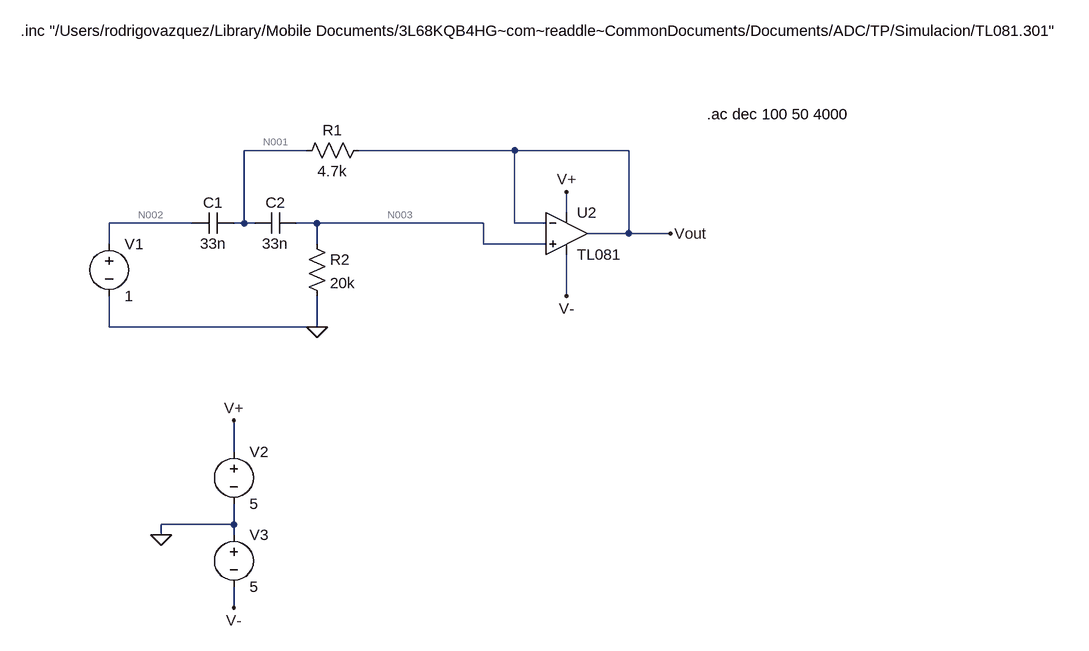
[diagram p0: schematic PasaAlto.asc]
PasaAlto.asc, the LTspice schematic file:
Version 4
SHEET 1 1524 828
WIRE 336 64 240 64
WIRE 656 64 416 64
WIRE 832 64 656 64
WIRE 736 160 736 128
WIRE 160 176 32 176
WIRE 240 176 240 64
WIRE 240 176 224 176
WIRE 256 176 240 176
WIRE 352 176 320 176
WIRE 608 176 352 176
WIRE 656 176 656 64
WIRE 704 176 656 176
WIRE 832 192 832 64
WIRE 832 192 768 192
WIRE 896 192 832 192
WIRE 32 208 32 176
WIRE 352 208 352 176
WIRE 608 208 608 176
WIRE 704 208 608 208
WIRE 736 288 736 224
WIRE 32 336 32 288
WIRE 352 336 352 288
WIRE 352 336 32 336
WIRE 224 528 224 480
WIRE 224 640 224 608
WIRE 224 640 112 640
WIRE 112 656 112 640
WIRE 224 656 224 640
WIRE 224 768 224 736
FLAG 112 656 0
FLAG 224 768 V-
FLAG 224 480 V+
FLAG 736 128 V+
FLAG 736 288 V-
FLAG 352 336 0
FLAG 896 192 Vout
SYMBOL cap 224 160 R90
WINDOW 0 0 32 VBottom 2
WINDOW 3 32 32 VTop 2
SYMATTR InstName C1
SYMATTR Value 33n
SYMBOL cap 320 160 R90
WINDOW 0 0 32 VBottom 2
WINDOW 3 32 32 VTop 2
SYMATTR InstName C2
SYMATTR Value 33n
SYMBOL res 336 192 R0
SYMATTR InstName R2
SYMATTR Value 20k
SYMBOL res 432 48 R90
WINDOW 0 0 56 VBottom 2
WINDOW 3 32 56 VTop 2
SYMATTR InstName R1
SYMATTR Value 4.7k
SYMBOL opamp2 736 128 R0
SYMATTR InstName U2
SYMATTR Value TL081
SYMBOL voltage 224 512 R0
SYMATTR InstName V2
SYMATTR Value 5
SYMBOL voltage 224 640 R0
SYMATTR InstName V3
SYMATTR Value 5
SYMBOL voltage 32 192 R0
SYMATTR InstName V1
SYMATTR Value 1
SYMATTR Value2 AC 1
TEXT -104 -120 Left 2 !.inc "/Users/rodrigovazquez/Library/Mobile Documents/3L68KQB4HG~com~readdle~CommonDocuments/Documents/ADC/TP/Simulacion/TL081.301"
TEXT 952 8 Left 2 !.ac dec 100 50 4000

The netlist it stands for:
* PasaAlto.asc
C1 N001 N002 33n
C2 N003 N001 33n
R2 N003 0 20k
R1 Vout N001 4.7k
XU2 N003 Vout V+ V- Vout TL081  ; pins In+ In- V+ V- OUT
V2 V+ 0 5
V3 0 V- 5
V1 N002 0 1 AC 1
.inc "/Users/rodrigovazquez/Library/Mobile Documents/3L68KQB4HG~com~readdle~CommonDocuments/Documents/ADC/TP/Simulacion/TL081.301"
.ac dec 100 50 4000
.backanno
.end

* Results of the author's LTspice run, read from the files saved beside the schematic
* Operating Point, zero values left out:
*   V(n001) = 10.27 µV
*   V(n002) = 1 V
*   V(n003) = -701.1 nV
*   V(vout) = 10.27 µV
*   V(v-) = -5 V
*   V(v+) = 5 V
*   I(R2) = -35.05 pA
*   I(V3) = -4.862 mA
*   I(V2) = -4.861 mA
*   Ix(u2:1) = 35.05 pA
*   Ix(u2:2) = 35.05 pA
*   Ix(u2:3) = 4.861 mA
*   Ix(u2:4) = -4.862 mA
*   Ix(u2:5) = -35.05 pA
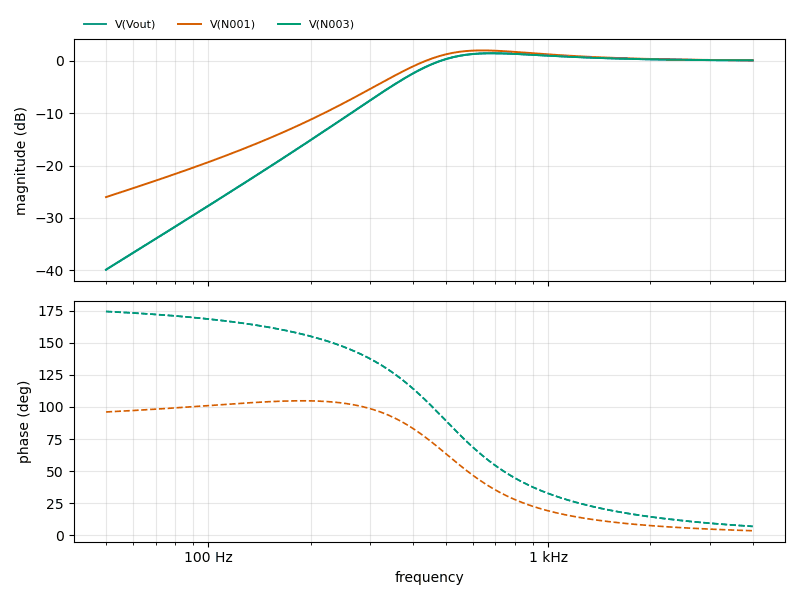
[diagram p1: AC Analysis of PasaAlto.asc, plotted from the saved traces]
* AC Analysis, 1 run:
*   V(Vout): -39.86 dB at 50 Hz, 0.07 dB at 4 kHz, peak 1.43 dB at 690.2 Hz, 3 dB below the peak at 423.7 Hz
*   V(N001): -26.02 dB at 50 Hz, 0.08 dB at 4 kHz, peak 1.97 dB at 644.1 Hz, 3 dB below the peak at 401.6 Hz
*   V(N003): -39.86 dB at 50 Hz, 0.07 dB at 4 kHz, peak 1.43 dB at 690.2 Hz, 3 dB below the peak at 423.7 Hz